# EAGLE schematic two_stick_basic (EAGLE 9.6.2)
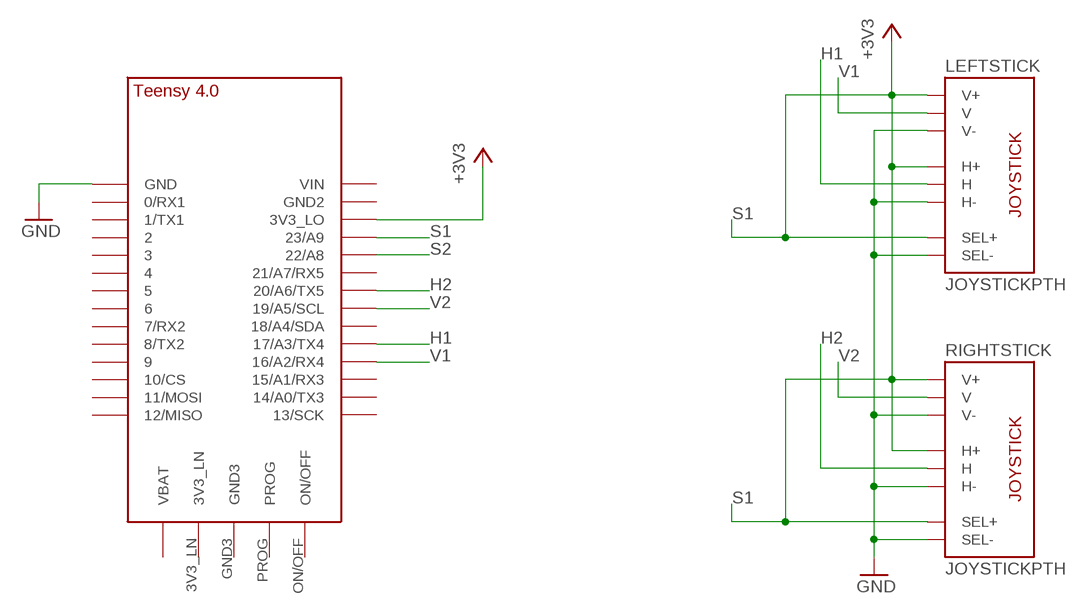
[diagram p0: schematic, sheet 1]

## Parts
LEFTSTICK  JOYSTICKPTH  [JOYSTICK]
RIGHTSTICK  JOYSTICKPTH  [JOYSTICK]
U$1  TEENSY_4.0-BASIC  [TEENSY_4.0-BASIC]

## Nets
+3V3: U$1.3V3_LO
GND: LEFTSTICK.B2A(SEL-) LEFTSTICK.H3(H-) LEFTSTICK.V3(V-) RIGHTSTICK.B2A(SEL-) RIGHTSTICK.H3(H-) RIGHTSTICK.V3(V-) U$1.GND
H1: LEFTSTICK.H2(H) U$1.17/A3(17/A3/TX4)
H2: RIGHTSTICK.H2(H) U$1.20/A6(20/A6/TX5)
S1: LEFTSTICK.B1A(SEL+) LEFTSTICK.H1(H+) LEFTSTICK.V1(V+) RIGHTSTICK.B1A(SEL+) RIGHTSTICK.H1(H+) RIGHTSTICK.V1(V+) U$1.23/A9 ; supply symbol labelled +3V3
S2: U$1.22/A8
V1: LEFTSTICK.V2(V) U$1.16/A2(16/A2/RX4)
V2: RIGHTSTICK.V2(V) U$1.19/A5/SCL
Unconnected: U$1.0/RX(0/RX1) U$1.1/TX(1/TX1) U$1.2 U$1.3/CANTX U$1.3V3_LN U$1.4/CANRX U$1.5 U$1.6 U$1.7(7/RX2) U$1.8(8/TX2) U$1.9/CS U$1.10/CS U$1.11/MOSI U$1.12/MISO U$1.13/SCK U$1.14/A0(14/A0/TX3) U$1.15/A1(15/A1/RX3) U$1.18/A4/SDA U$1.21/A7(21/A7/RX5) U$1.GND2 U$1.GND3 U$1.ON/OFF U$1.PROG U$1.VBAT\(VBAT) U$1.VIN

## Library data of the parts
LEFTSTICK RIGHTSTICK = adafruit:JOYSTICK: Thumb Joystick Joystick commonly found in PS2 controllers. Two pots and a select switch. Adapted from Sparkfun Library (but for more common 6mm switch sticks)
U$1 = Teensy-4.0:TEENSY_4.0-BASIC

## Net classes
0 default: width 0.127 mm